# Altium schematic sheet MCU.SchDoc
size A4
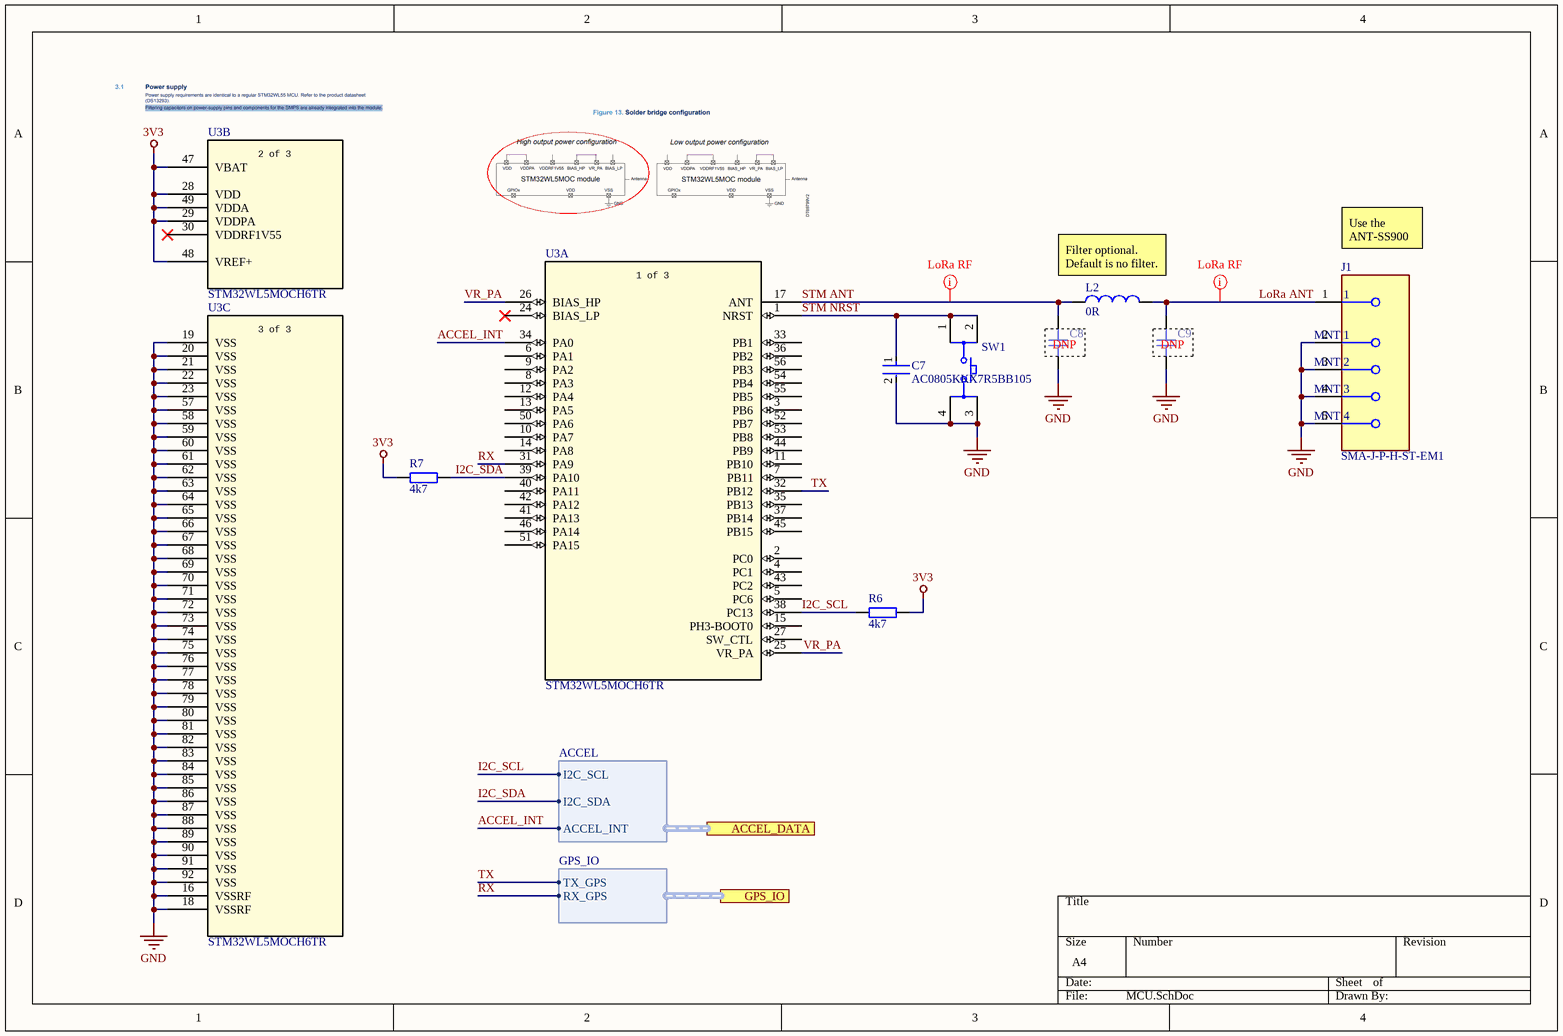
[diagram p0: MCU.SchDoc]

## Parts
C7  AC0805KKX7R5BB105  [FP-AC0805-0_85-MFG]
C8  (no value)  [CAP_0603]
C9  (no value)  [CAP_0603]
J1  SMA-J-P-H-ST-EM1  [FP-SMA-J-P-H-ST-EM1-MFG]
L2  0R  [CAP_0603]
R6  4k7  [RES_0603]
R7  4k7  [RES_0603]
SW1  TL3301AF160QG  [FP-TL3301AF160QG-MFG]  (value not drawn)
U3  STM32WL5MOCH6TR  [LGA-92_10X10_STM]  (parts A,B,C of 3)

## Ports
ACCEL_DATA (harness ACCEL), GPS_IO (harness GPS_IO)

## Harnesses
ACCEL: I2C_SCL, ACCEL_INT, I2C_SDA
GPS_IO: TX_GPS, RX_GPS

## Nets
3V3: R6.2 R7.2 U3.28(VDD) U3.29(VDDPA) U3.47(VBAT) U3.48(VREF+) U3.49(VDDA)
GND: C7.2 C8.1 C9.1 J1.2(MNT_1) J1.3(MNT_2) J1.4(MNT_3) J1.5(MNT_4) SW1.3 SW1.4 U3.16(VSSRF) U3.18(VSSRF) U3.19(VSS) U3.20(VSS) U3.21(VSS) U3.22(VSS) U3.23(VSS) U3.57(VSS) U3.58(VSS) U3.59(VSS) U3.60(VSS) U3.61(VSS) U3.62(VSS) U3.63(VSS) U3.64(VSS) U3.65(VSS) U3.66(VSS) U3.67(VSS) U3.68(VSS) U3.69(VSS) U3.70(VSS) U3.71(VSS) U3.72(VSS) U3.73(VSS) U3.74(VSS) U3.75(VSS) U3.76(VSS) U3.77(VSS) U3.78(VSS) U3.79(VSS) U3.80(VSS) U3.81(VSS) U3.82(VSS) U3.83(VSS) U3.84(VSS) U3.85(VSS) U3.86(VSS) U3.87(VSS) U3.88(VSS) U3.89(VSS) U3.90(VSS) U3.91(VSS) U3.92(VSS)
ACCEL_INT: U3.34(PA0) ; port ACCEL_DATA.ACCEL_INT
I2C_SCL: R6.1 U3.38(PC13) ; port ACCEL_DATA.I2C_SCL
I2C_SDA: R7.1 U3.39(PA10) ; port ACCEL_DATA.I2C_SDA
LoRa ANT: C9.2 J1.1 L2.2
RX: U3.31(PA9) ; port GPS_IO.RX_GPS
STM ANT: C8.2 L2.1 U3.17(ANT)
STM NRST: C7.1 SW1.1 SW1.2 U3.1(NRST)
TX: U3.32(PB12) ; port GPS_IO.TX_GPS
VR_PA: U3.25(VR_PA) U3.26(BIAS_HP)

Not connected (* = marked no-connect by the designer): U3 2(PC0) 3(PB6) 4(PC1) 5(PC6) 6(PA1) 7(PB11) 8(PA3) 9(PA2) 10(PA7) 11(PB10) 12(PA4) 13(PA5) 14(PA8) 15(PH3-BOOT0) 24(BIAS_LP)* 27(SW_CTL) 30(VDDRF1V55)* 33(PB1) 35(PB13) 36(PB2) 37(PB14) 40(PA11) 41(PA13) 42(PA12) 43(PC2) 44(PB9) 45(PB15) 46(PA14) 50(PA6) 51(PA15) 52(PB7) 53(PB8) 54(PB4) 55(PB5) 56(PB3)

## Layout directives
net class LoRa RF: LoRa ANT, STM ANT

## Notes on the sheet
- Use the ANT-SS900
- (near L2) Filter optional.
  Default is no filter.
- (near C8) DNP
- (near C9) DNP
- (in symbol STM32WL5MOCH6TR, part A) 1 of 3
- (in symbol STM32WL5MOCH6TR, part B) 2 of 3
- (in symbol STM32WL5MOCH6TR, part C) 3 of 3

## Library data of the parts
C7 = CMP-03422-000426-1: AC0805 1 uF X7R 10.00% 6.3 V; Manufacturer: Yageo; Material: Ceramic; Temperature Coefficient: 15%; Value: 1 uF; Tolerance: 0.1; Automotive Grade: Grade 1; Voltage Rating: 6.3 V; Temperature Characteristic: X7R; Device Class L3: Ceramic Capacitors; RoHS: TRUE; ComponentLink2Description: Datasheet; Device Class L2: Capacitors; Temperature Range Low: -55°C; Temperature: -55°C to +125°C; Temperature Range High: +125°C; ComponentLink2URL: http://www.yageo.com/documents/recent/UPY-AC_NP0X7R_16V-to-630V_12.pdf; Device Class L1: Passive Components; Footprint Url: http://www.yageo.com/exep/pages/download/literatures/UPY-C_GEN_24.pdf; Height: 0.95mm; Manufacturer Part Number: AC0805KKX7R5BB105; Octopart: https://octopart.com/ac0805kkx7r5bb105-yageo-78873385; Package: AC0805-0.85; Ipc Land Pattern Name: CAPC200125X85; Automotive: Yes; Category: Cap; Lead Free: Yes; Capacitance: 1 uF
C8 C9 = CAP_0603: Capacitor SMD 0603 / Ceramic; Manufacturer: *; Manufacturer Part Number: *; Distributor Link: *; LCSC: *; Rating: *; Dielectric: *
J1 = LoRa antenna connector: CONN SMA JACK STR 50OHM EDGE MNT / Use the ANT-SS900; Dielectric Material: PTFE; Center Contact Plating: Gold; Max Frequency: 6GHz; Body Material: Brass; Voltage Rating: 335V; Impedance: 50R; Package Quantity: 1; Case/Package: SMA; Max Operating Temperature: 125°C; Fastening Type: Threaded; Orientation: Straight; Depth: 13.33mm; RoHS Compliant: Yes; Length: 6.35mm; Insulation Material: Polytetrafluoroethylene; Termination: Solder; Min Operating Temperature: -65°C; Housing Color: Gold; Contact Plating: Gold; Contact Material: Copper; Connector Type: SMA; Mount: Edge; Series: SMA; Packaging: Tray; Body Plating: Gold; Radiation Hardening: No
L2 = Inductor: Not necessary. Place 0 ohm resistor; MP: LQG18HN27NJ00D; Package: None; Price: None; Value: *; Availability: Unavailable
R6 R7 = RES_0603: Resistor SMD 0603; Manufacturer: *; Manufacturer Part Number: *; Distributor Link: *; LCSC: *
SW1 = CMP-17879-000012-1: SWITCH TACTILE SPST-NO 0.05A 12V; Actuator Type: Standard; Current Rating: 50mA; Contact Resistance: 100mR; Max Voltage Rating (DC): 50V; Actuator Length: 1.4mm; Electrical Life: 100000Cycles; Throw Configuration: SPST; Switch Travel: 0.25mm; Operating Force: 160gf; Switch Function: Off-Mom; Actuator Material: Nylon; Illumination Type: Non-Illuminated; Orientation: Straight; Lead Free: Lead Free; Contact Material: Silver; Series: TL3301; Mount: Surface Mount; Voltage Rating: 50V; REACH SVHC: No SVHC; Voltage Rating (DC): 12V; Packaging: Tape and Reel; Termination: Gull Wing; RoHS Compliant: Yes; Min Operating Temperature: -20°C; Package Quantity: 1000; Mechanical Life: 100000Cycles; Contact Plating: Silver; Max Operating Temperature: 70°C; Insulation Resistance: 100MR
U3 = STM32WL5MOCH6TR: Multiprotocol LPWAN dual-core module 32-bit Arm Cortex-M4/M0+ LoRa,(G)FSK, (G)MSK, BPSK; Manufacturer_Name: STMicroelectronics; Copyright: Copyright (C) 2026 Ultra Librarian. All rights reserved.; Manufacturer_Part_Number: STM32WL5MOCH6TR; Datasheet: https://www.st.com/resource/en/datasheet/stm32wl5moc.pdf; RefDes: RefDes; Type: Type